# Altium schematic sheet Alaska 1-1.SchDoc
size A0; SheetNumber: 1; SheetTotal: 1
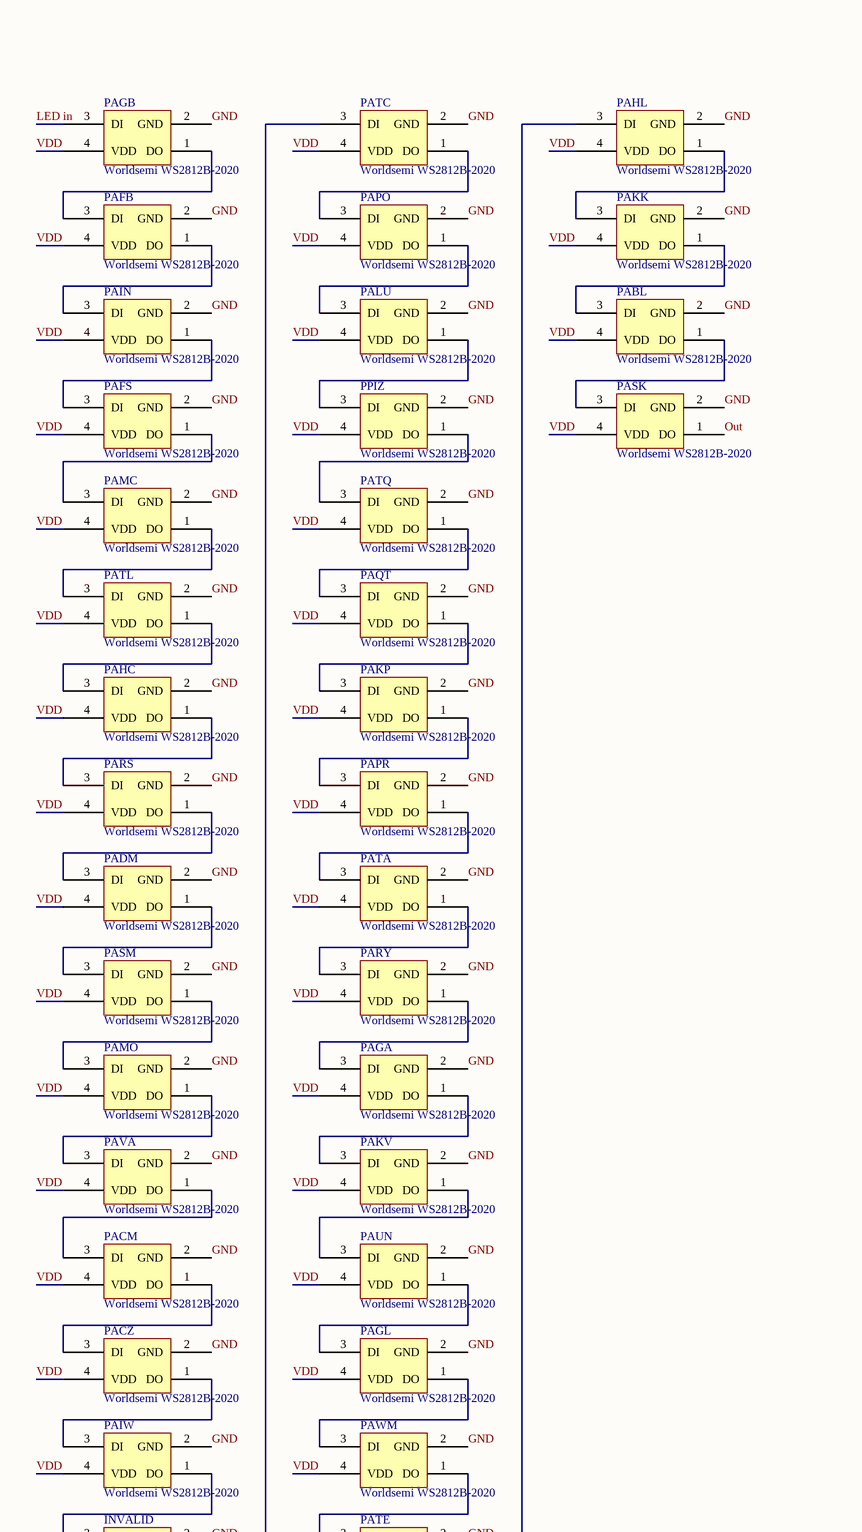
[diagram p0: Alaska 1-1.SchDoc, top left]
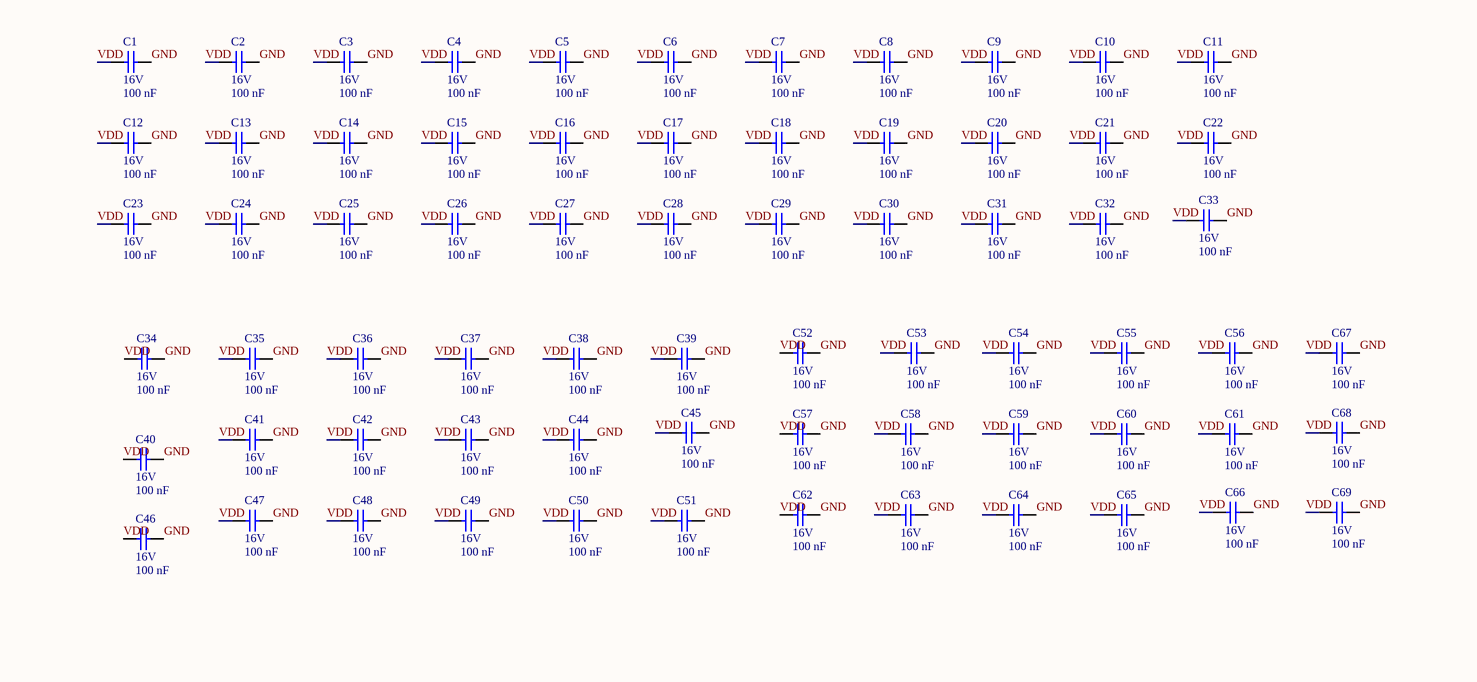
[diagram p1: Alaska 1-1.SchDoc, top middle]
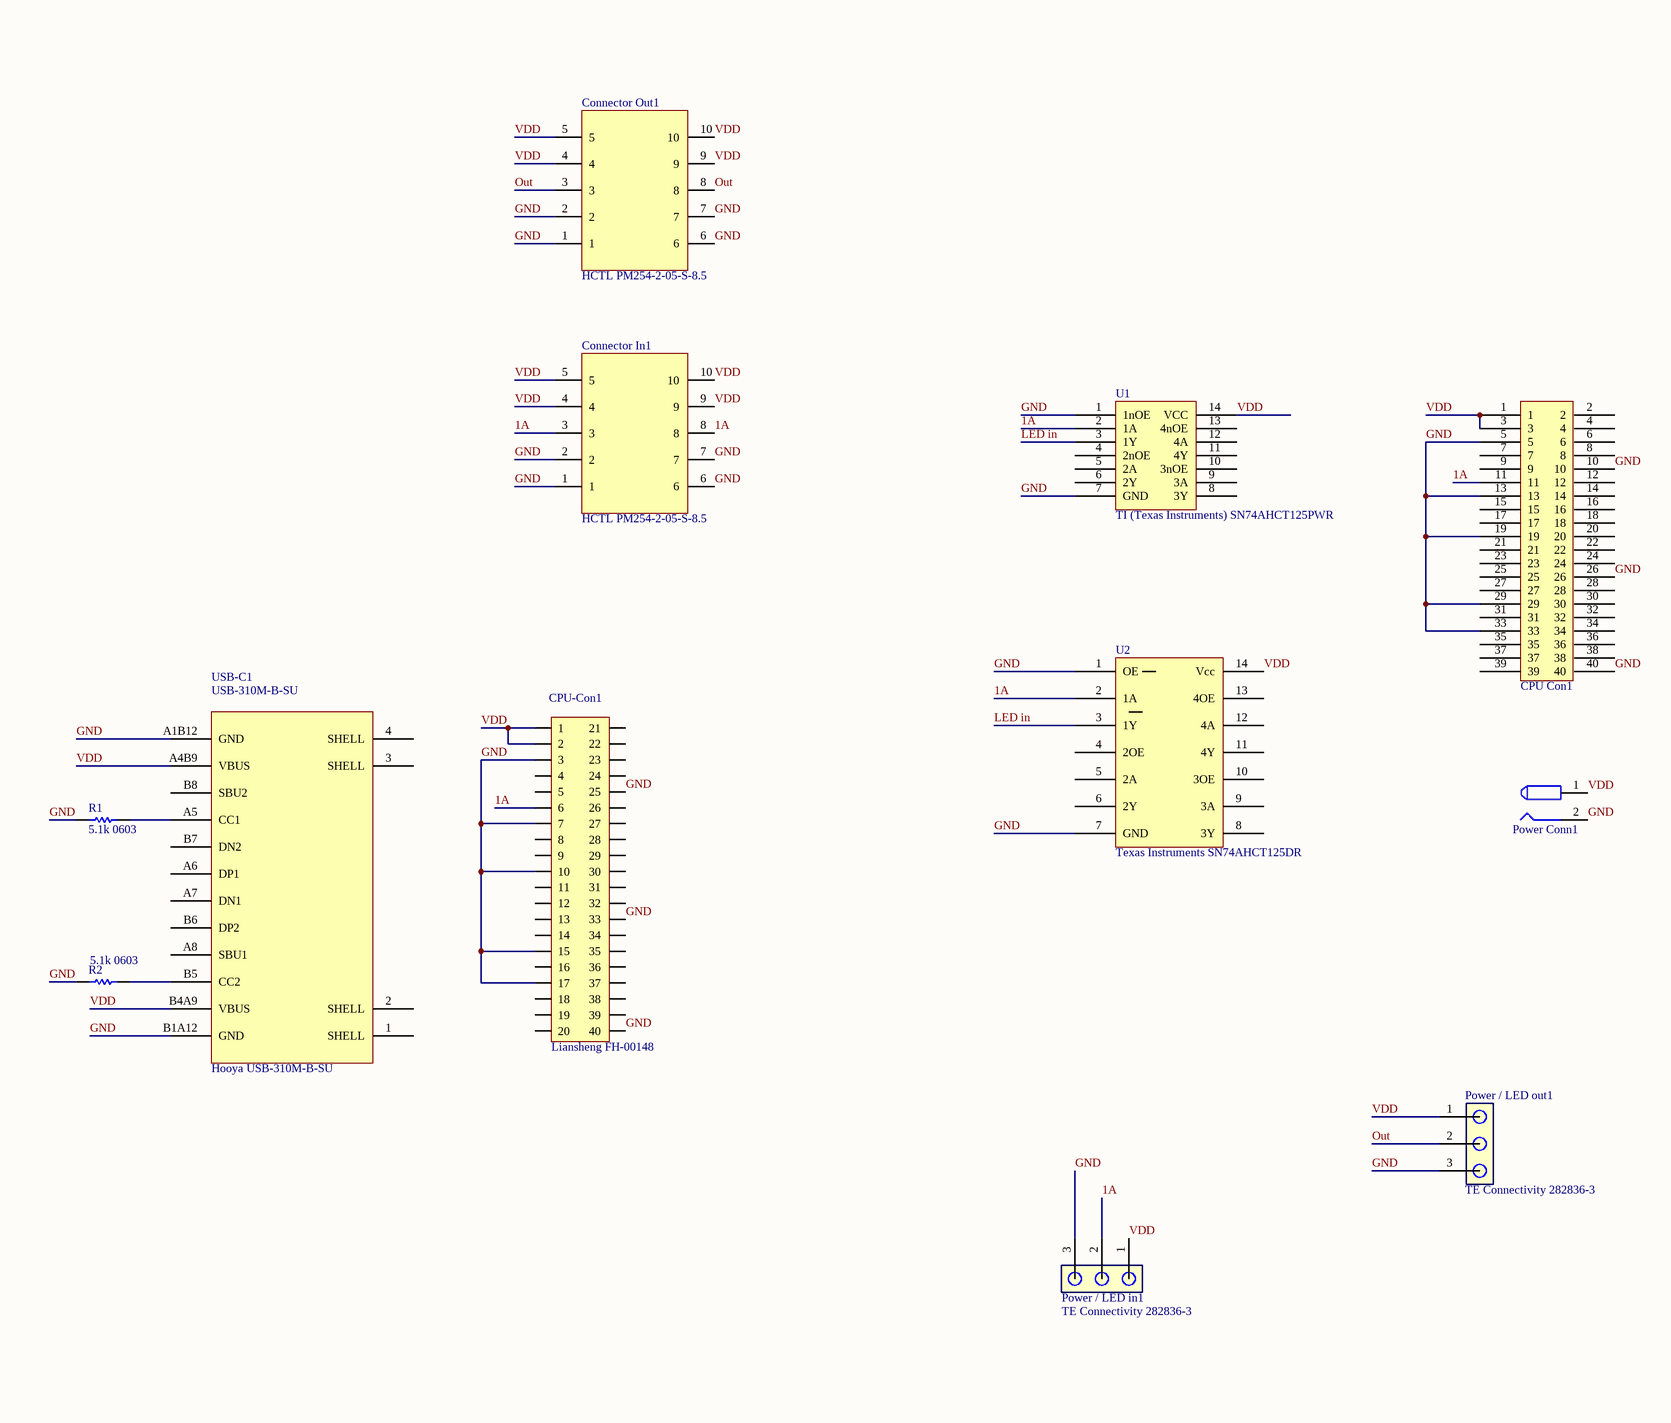
[diagram p2: Alaska 1-1.SchDoc, top right]
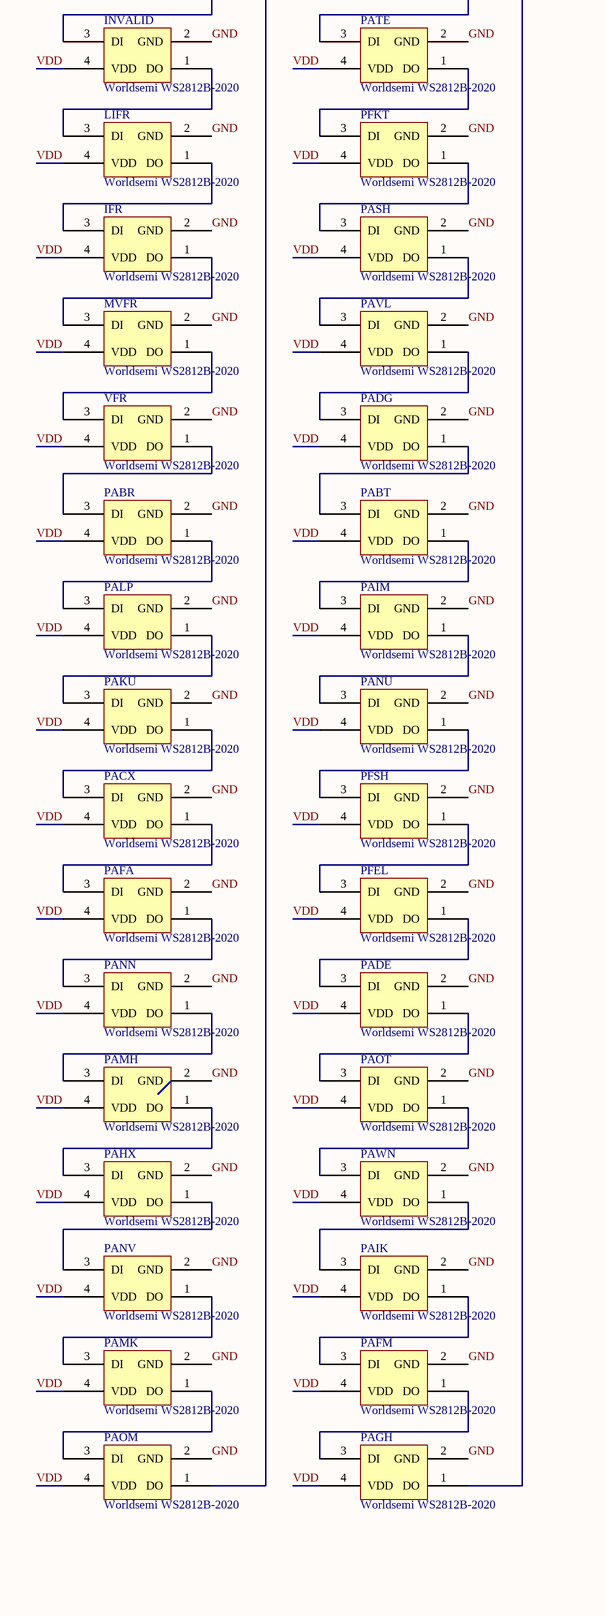
[diagram p3: Alaska 1-1.SchDoc, bottom left]
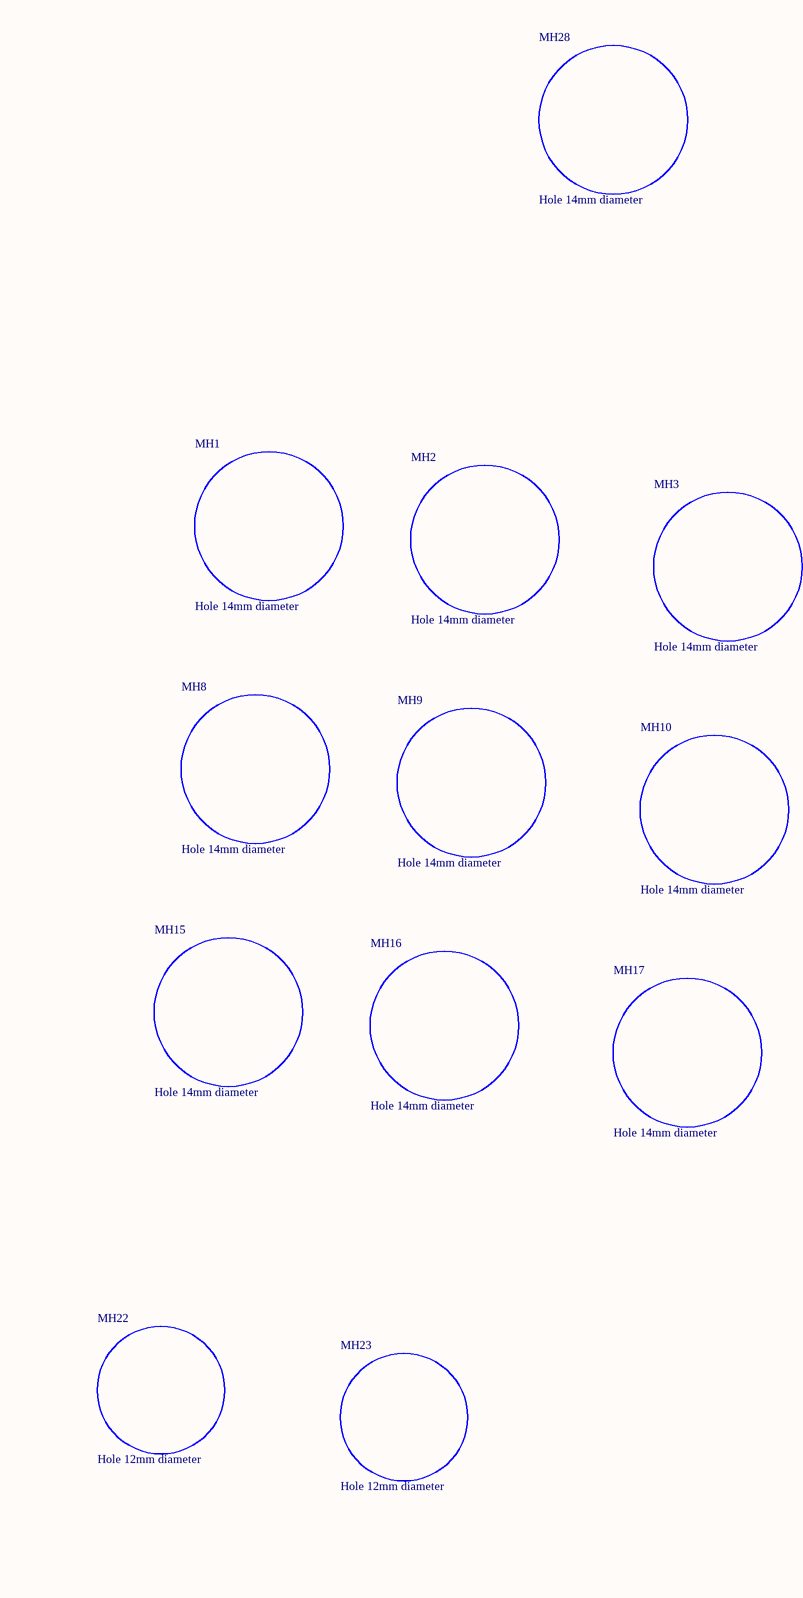
[diagram p4: Alaska 1-1.SchDoc, bottom middle]
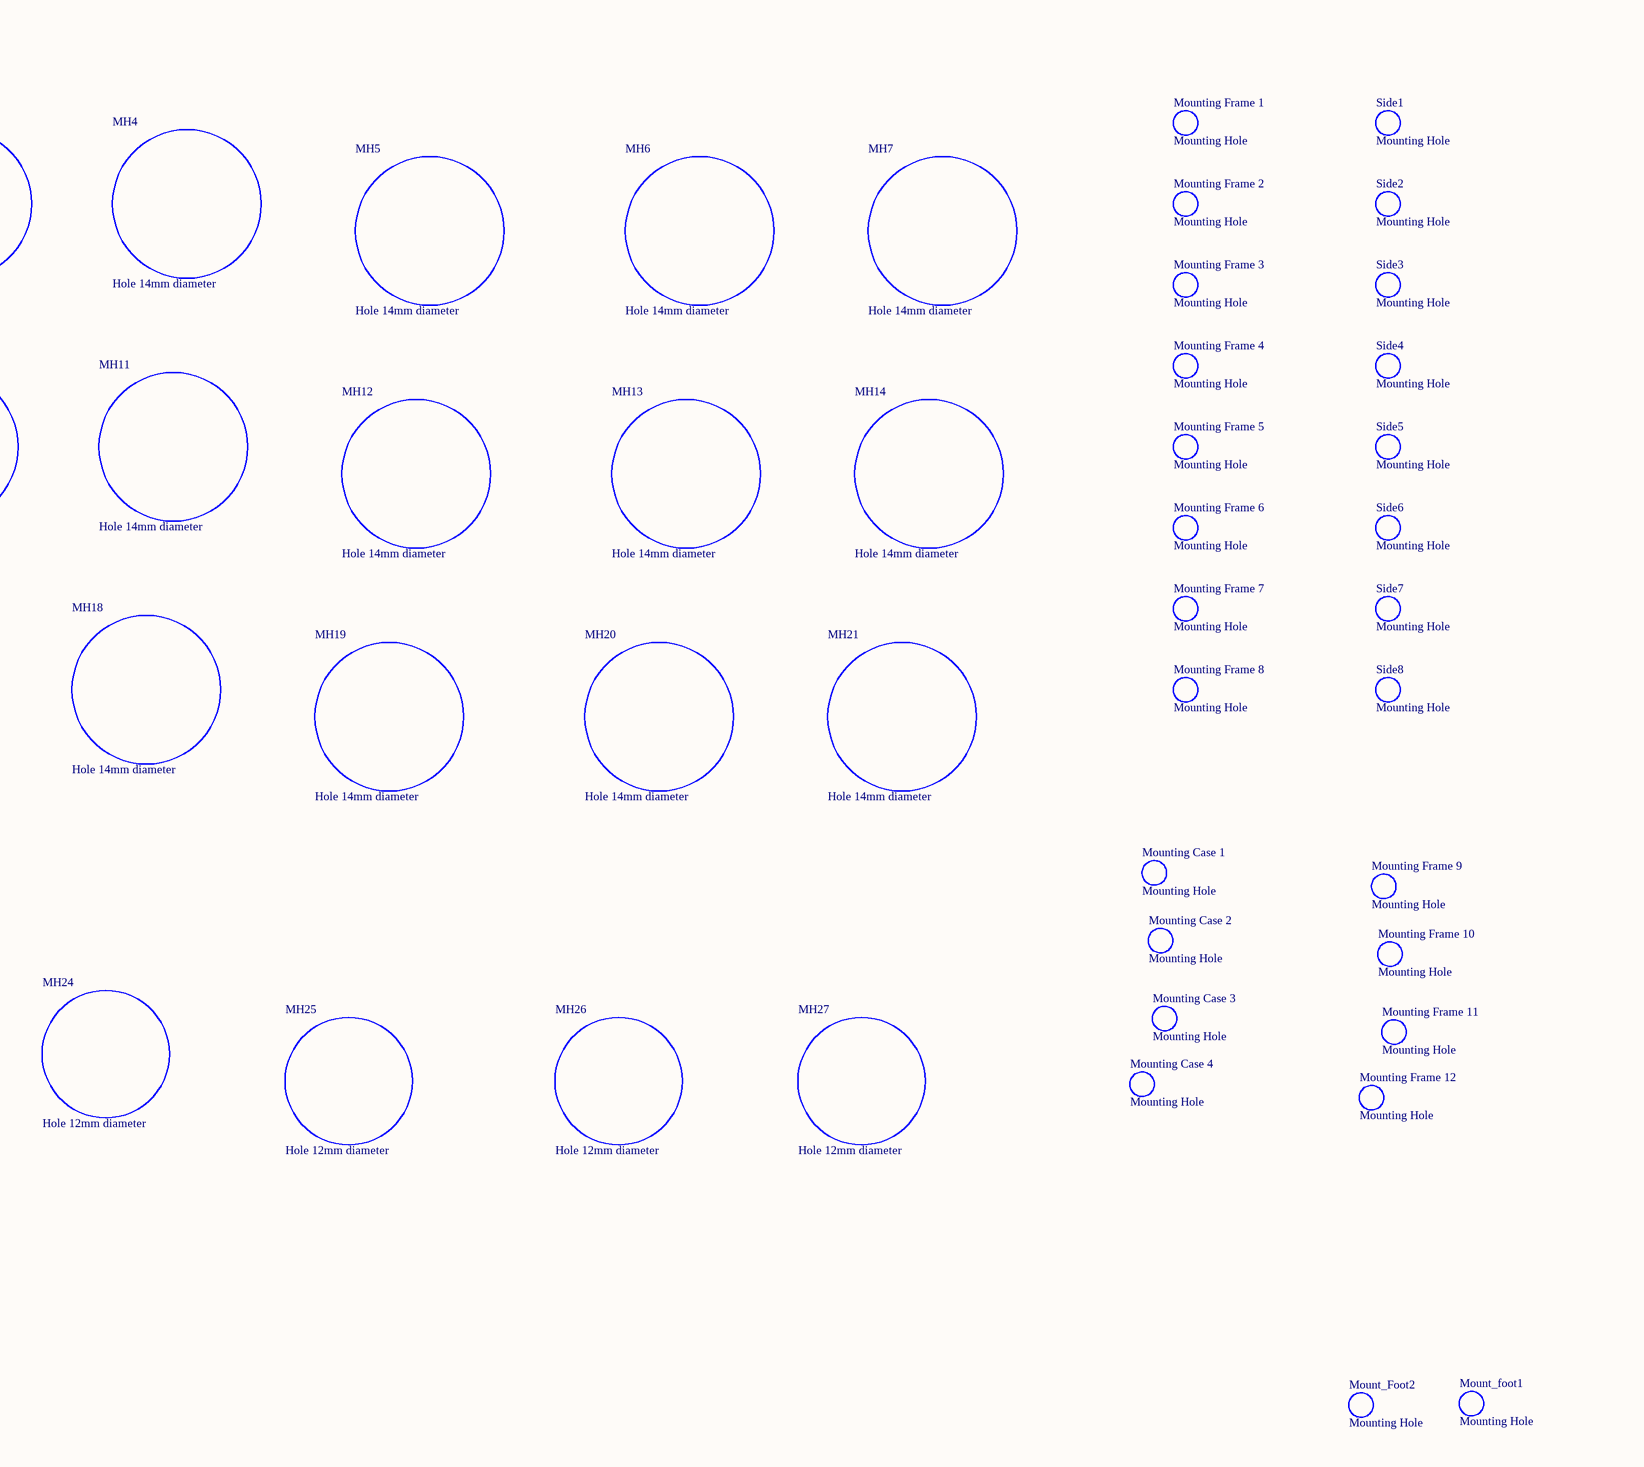
[diagram p5: Alaska 1-1.SchDoc, bottom right]

## Parts
C1  16V  Capacitance: 100 nF  [CAPC1005X56X25NL10T15]
C2  16V  Capacitance: 100 nF  [CAPC1005X56X25NL10T15]
C3  16V  Capacitance: 100 nF  [CAPC1005X56X25NL10T15]
C4  16V  Capacitance: 100 nF  [CAPC1005X56X25NL10T15]
C5  16V  Capacitance: 100 nF  [CAPC1005X56X25NL10T15]
C6  16V  Capacitance: 100 nF  [CAPC1005X56X25NL10T15]
C7  16V  Capacitance: 100 nF  [CAPC1005X56X25NL10T15]
C8  16V  Capacitance: 100 nF  [CAPC1005X56X25NL10T15]
C9  16V  Capacitance: 100 nF  [CAPC1005X56X25NL10T15]
C10  16V  Capacitance: 100 nF  [CAPC1005X56X25NL10T15]
C11  16V  Capacitance: 100 nF  [CAPC1005X56X25NL10T15]
C12  16V  Capacitance: 100 nF  [CAPC1005X56X25NL10T15]
C13  16V  Capacitance: 100 nF  [CAPC1005X56X25NL10T15]
C14  16V  Capacitance: 100 nF  [CAPC1005X56X25NL10T15]
C15  16V  Capacitance: 100 nF  [CAPC1005X56X25NL10T15]
C16  16V  Capacitance: 100 nF  [CAPC1005X56X25NL10T15]
C17  16V  Capacitance: 100 nF  [CAPC1005X56X25NL10T15]
C18  16V  Capacitance: 100 nF  [CAPC1005X56X25NL10T15]
C19  16V  Capacitance: 100 nF  [CAPC1005X56X25NL10T15]
C20  16V  Capacitance: 100 nF  [CAPC1005X56X25NL10T15]
C21  16V  Capacitance: 100 nF  [CAPC1005X56X25NL10T15]
C22  16V  Capacitance: 100 nF  [CAPC1005X56X25NL10T15]
C23  16V  Capacitance: 100 nF  [CAPC1005X56X25NL10T15]
C24  16V  Capacitance: 100 nF  [CAPC1005X56X25NL10T15]
C25  16V  Capacitance: 100 nF  [CAPC1005X56X25NL10T15]
C26  16V  Capacitance: 100 nF  [CAPC1005X56X25NL10T15]
C27  16V  Capacitance: 100 nF  [CAPC1005X56X25NL10T15]
C28  16V  Capacitance: 100 nF  [CAPC1005X56X25NL10T15]
C29  16V  Capacitance: 100 nF  [CAPC1005X56X25NL10T15]
C30  16V  Capacitance: 100 nF  [CAPC1005X56X25NL10T15]
C31  16V  Capacitance: 100 nF  [CAPC1005X56X25NL10T15]
C32  16V  Capacitance: 100 nF  [CAPC1005X56X25NL10T15]
C33  16V  Capacitance: 100 nF  [CAPC1005X56X25NL10T15]
C34  16V  Capacitance: 100 nF  [CAPC1005X56X25NL10T15]
C35  16V  Capacitance: 100 nF  [CAPC1005X56X25NL10T15]
C36  16V  Capacitance: 100 nF  [CAPC1005X56X25NL10T15]
C37  16V  Capacitance: 100 nF  [CAPC1005X56X25NL10T15]
C38  16V  Capacitance: 100 nF  [CAPC1005X56X25NL10T15]
C39  16V  Capacitance: 100 nF  [CAPC1005X56X25NL10T15]
C40  16V  Capacitance: 100 nF  [CAPC1005X56X25NL10T15]
C41  16V  Capacitance: 100 nF  [CAPC1005X56X25NL10T15]
C42  16V  Capacitance: 100 nF  [CAPC1005X56X25NL10T15]
C43  16V  Capacitance: 100 nF  [CAPC1005X56X25NL10T15]
C44  16V  Capacitance: 100 nF  [CAPC1005X56X25NL10T15]
C45  16V  Capacitance: 100 nF  [CAPC1005X56X25NL10T15]
C46  16V  Capacitance: 100 nF  [CAPC1005X56X25NL10T15]
C47  16V  Capacitance: 100 nF  [CAPC1005X56X25NL10T15]
C48  16V  Capacitance: 100 nF  [CAPC1005X56X25NL10T15]
C49  16V  Capacitance: 100 nF  [CAPC1005X56X25NL10T15]
C50  16V  Capacitance: 100 nF  [CAPC1005X56X25NL10T15]
C51  16V  Capacitance: 100 nF  [CAPC1005X56X25NL10T15]
C52  16V  Capacitance: 100 nF  [CAPC1005X56X25NL10T15]
C53  16V  Capacitance: 100 nF  [CAPC1005X56X25NL10T15]
C54  16V  Capacitance: 100 nF  [CAPC1005X56X25NL10T15]
C55  16V  Capacitance: 100 nF  [CAPC1005X56X25NL10T15]
C56  16V  Capacitance: 100 nF  [CAPC1005X56X25NL10T15]
C57  16V  Capacitance: 100 nF  [CAPC1005X56X25NL10T15]
C58  16V  Capacitance: 100 nF  [CAPC1005X56X25NL10T15]
C59  16V  Capacitance: 100 nF  [CAPC1005X56X25NL10T15]
C60  16V  Capacitance: 100 nF  [CAPC1005X56X25NL10T15]
C61  16V  Capacitance: 100 nF  [CAPC1005X56X25NL10T15]
C62  16V  Capacitance: 100 nF  [CAPC1005X56X25NL10T15]
C63  16V  Capacitance: 100 nF  [CAPC1005X56X25NL10T15]
C64  16V  Capacitance: 100 nF  [CAPC1005X56X25NL10T15]
C65  16V  Capacitance: 100 nF  [CAPC1005X56X25NL10T15]
C66  16V  Capacitance: 100 nF  [CAPC1005X56X25NL10T15]
C67  16V  Capacitance: 100 nF  [CAPC1005X56X25NL10T15]
C68  16V  Capacitance: 100 nF  [CAPC1005X56X25NL10T15]
C69  16V  Capacitance: 100 nF  [CAPC1005X56X25NL10T15]
Connector_In1  HCTL PM254-2-05-S-8.5  [PM254-2-05-S-8.5]
Connector_Out1  HCTL PM254-2-05-S-8.5  [PM254-2-05-S-8.5]
CPU-Con1  Liansheng FH-00148  [Liansheng_FH-00148_Footprint_01]
CPU_Con1  40 pin Female connector  [Harwin 40 pin Female]  (value not drawn)
IFR  Worldsemi WS2812B-2020  [PCB-18681qzhn4j348g96a9l-1]
INVALID  Worldsemi WS2812B-2020  [PCB-18681qzhn4j348g96a9l-1]
LIFR  Worldsemi WS2812B-2020  [PCB-18681qzhn4j348g96a9l-1]
MH1  Hole 14mm diameter  [Mounting Hole 14mm]
MH2  Hole 14mm diameter  [Mounting Hole 14mm]
MH3  Hole 14mm diameter  [Mounting Hole 14mm]
MH4  Hole 14mm diameter  [Mounting Hole 14mm]
MH5  Hole 14mm diameter  [Mounting Hole 14mm]
MH6  Hole 14mm diameter  [Mounting Hole 14mm]
MH7  Hole 14mm diameter  [Mounting Hole 14mm]
MH8  Hole 14mm diameter  [Mounting Hole 14mm]
MH9  Hole 14mm diameter  [Mounting Hole 14mm]
MH10  Hole 14mm diameter  [Mounting Hole 14mm]
MH11  Hole 14mm diameter  [Mounting Hole 14mm]
MH12  Hole 14mm diameter  [Mounting Hole 14mm]
MH13  Hole 14mm diameter  [Mounting Hole 14mm]
MH14  Hole 14mm diameter  [Mounting Hole 14mm]
MH15  Hole 14mm diameter  [Mounting Hole 14mm]
MH16  Hole 14mm diameter  [Mounting Hole 14mm]
MH17  Hole 14mm diameter  [Mounting Hole 14mm]
MH18  Hole 14mm diameter  [Mounting Hole 14mm]
MH19  Hole 14mm diameter  [Mounting Hole 14mm]
MH20  Hole 14mm diameter  [Mounting Hole 14mm]
MH21  Hole 14mm diameter  [Mounting Hole 14mm]
MH22  Hole 12mm diameter  [Mounting Hole 12mm]
MH23  Hole 12mm diameter  [Mounting Hole 12mm]
MH24  Hole 12mm diameter  [Mounting Hole 12mm]
MH25  Hole 12mm diameter  [Mounting Hole 12mm]
MH26  Hole 12mm diameter  [Mounting Hole 12mm]
MH27  Hole 12mm diameter  [Mounting Hole 12mm]
MH28  Hole 14mm diameter  [Mounting Hole 14mm]
Mount_foot1  Mounting Hole  [PCB-q0vxx67e01kaxtvhakkm-1]
Mount_Foot2  Mounting Hole  [PCB-q0vxx67e01kaxtvhakkm-1]
Mounting_Case_1  Mounting Hole  [PCB-q0vxx67e01kaxtvhakkm-1]
Mounting_Case_2  Mounting Hole  [PCB-q0vxx67e01kaxtvhakkm-1]
Mounting_Case_3  Mounting Hole  [PCB-q0vxx67e01kaxtvhakkm-1]
Mounting_Case_4  Mounting Hole  [PCB-q0vxx67e01kaxtvhakkm-1]
Mounting_Frame_1  Mounting Hole  [PCB-q0vxx67e01kaxtvhakkm-1]
Mounting_Frame_2  Mounting Hole  [PCB-q0vxx67e01kaxtvhakkm-1]
Mounting_Frame_3  Mounting Hole  [PCB-q0vxx67e01kaxtvhakkm-1]
Mounting_Frame_4  Mounting Hole  [PCB-q0vxx67e01kaxtvhakkm-1]
Mounting_Frame_5  Mounting Hole  [PCB-q0vxx67e01kaxtvhakkm-1]
Mounting_Frame_6  Mounting Hole  [PCB-q0vxx67e01kaxtvhakkm-1]
Mounting_Frame_7  Mounting Hole  [PCB-q0vxx67e01kaxtvhakkm-1]
Mounting_Frame_8  Mounting Hole  [PCB-q0vxx67e01kaxtvhakkm-1]
Mounting_Frame_9  Mounting Hole  [PCB-q0vxx67e01kaxtvhakkm-1]
Mounting_Frame_10  Mounting Hole  [PCB-q0vxx67e01kaxtvhakkm-1]
Mounting_Frame_11  Mounting Hole  [PCB-q0vxx67e01kaxtvhakkm-1]
Mounting_Frame_12  Mounting Hole  [PCB-q0vxx67e01kaxtvhakkm-1]
MVFR  Worldsemi WS2812B-2020  [PCB-18681qzhn4j348g96a9l-1]
PABL  Worldsemi WS2812B-2020  [PCB-18681qzhn4j348g96a9l-1]
PABR  Worldsemi WS2812B-2020  [PCB-18681qzhn4j348g96a9l-1]
PABT  Worldsemi WS2812B-2020  [PCB-18681qzhn4j348g96a9l-1]
PACM  Worldsemi WS2812B-2020  [PCB-18681qzhn4j348g96a9l-1]
PACX  Worldsemi WS2812B-2020  [PCB-18681qzhn4j348g96a9l-1]
PACZ  Worldsemi WS2812B-2020  [PCB-18681qzhn4j348g96a9l-1]
PADE  Worldsemi WS2812B-2020  [PCB-18681qzhn4j348g96a9l-1]
PADG  Worldsemi WS2812B-2020  [PCB-18681qzhn4j348g96a9l-1]
PADM  Worldsemi WS2812B-2020  [PCB-18681qzhn4j348g96a9l-1]
PAFA  Worldsemi WS2812B-2020  [PCB-18681qzhn4j348g96a9l-1]
PAFB  Worldsemi WS2812B-2020  [PCB-18681qzhn4j348g96a9l-1]
PAFM  Worldsemi WS2812B-2020  [PCB-18681qzhn4j348g96a9l-1]
PAFS  Worldsemi WS2812B-2020  [PCB-18681qzhn4j348g96a9l-1]
PAGA  Worldsemi WS2812B-2020  [PCB-18681qzhn4j348g96a9l-1]
PAGB  Worldsemi WS2812B-2020  [PCB-18681qzhn4j348g96a9l-1]
PAGH  Worldsemi WS2812B-2020  [PCB-18681qzhn4j348g96a9l-1]
PAGL  Worldsemi WS2812B-2020  [PCB-18681qzhn4j348g96a9l-1]
PAHC  Worldsemi WS2812B-2020  [PCB-18681qzhn4j348g96a9l-1]
PAHL  Worldsemi WS2812B-2020  [PCB-18681qzhn4j348g96a9l-1]
PAHX  Worldsemi WS2812B-2020  [PCB-18681qzhn4j348g96a9l-1]
PAIK  Worldsemi WS2812B-2020  [PCB-18681qzhn4j348g96a9l-1]
PAIM  Worldsemi WS2812B-2020  [PCB-18681qzhn4j348g96a9l-1]
PAIN  Worldsemi WS2812B-2020  [PCB-18681qzhn4j348g96a9l-1]
PAIW  Worldsemi WS2812B-2020  [PCB-18681qzhn4j348g96a9l-1]
PAKK  Worldsemi WS2812B-2020  [PCB-18681qzhn4j348g96a9l-1]
PAKP  Worldsemi WS2812B-2020  [PCB-18681qzhn4j348g96a9l-1]
PAKU  Worldsemi WS2812B-2020  [PCB-18681qzhn4j348g96a9l-1]
PAKV  Worldsemi WS2812B-2020  [PCB-18681qzhn4j348g96a9l-1]
PALP  Worldsemi WS2812B-2020  [PCB-18681qzhn4j348g96a9l-1]
PALU  Worldsemi WS2812B-2020  [PCB-18681qzhn4j348g96a9l-1]
PAMC  Worldsemi WS2812B-2020  [PCB-18681qzhn4j348g96a9l-1]
PAMH  Worldsemi WS2812B-2020  [PCB-18681qzhn4j348g96a9l-1]
PAMK  Worldsemi WS2812B-2020  [PCB-18681qzhn4j348g96a9l-1]
PAMO  Worldsemi WS2812B-2020  [PCB-18681qzhn4j348g96a9l-1]
PANN  Worldsemi WS2812B-2020  [PCB-18681qzhn4j348g96a9l-1]
PANU  Worldsemi WS2812B-2020  [PCB-18681qzhn4j348g96a9l-1]
PANV  Worldsemi WS2812B-2020  [PCB-18681qzhn4j348g96a9l-1]
PAOM  Worldsemi WS2812B-2020  [PCB-18681qzhn4j348g96a9l-1]
PAOT  Worldsemi WS2812B-2020  [PCB-18681qzhn4j348g96a9l-1]
PAPO  Worldsemi WS2812B-2020  [PCB-18681qzhn4j348g96a9l-1]
PAPR  Worldsemi WS2812B-2020  [PCB-18681qzhn4j348g96a9l-1]
PAQT  Worldsemi WS2812B-2020  [PCB-18681qzhn4j348g96a9l-1]
PARS  Worldsemi WS2812B-2020  [PCB-18681qzhn4j348g96a9l-1]
PARY  Worldsemi WS2812B-2020  [PCB-18681qzhn4j348g96a9l-1]
PASH  Worldsemi WS2812B-2020  [PCB-18681qzhn4j348g96a9l-1]
PASK  Worldsemi WS2812B-2020  [PCB-18681qzhn4j348g96a9l-1]
PASM  Worldsemi WS2812B-2020  [PCB-18681qzhn4j348g96a9l-1]
PATA  Worldsemi WS2812B-2020  [PCB-18681qzhn4j348g96a9l-1]
PATC  Worldsemi WS2812B-2020  [PCB-18681qzhn4j348g96a9l-1]
PATE  Worldsemi WS2812B-2020  [PCB-18681qzhn4j348g96a9l-1]
PATL  Worldsemi WS2812B-2020  [PCB-18681qzhn4j348g96a9l-1]
PATQ  Worldsemi WS2812B-2020  [PCB-18681qzhn4j348g96a9l-1]
PAUN  Worldsemi WS2812B-2020  [PCB-18681qzhn4j348g96a9l-1]
PAVA  Worldsemi WS2812B-2020  [PCB-18681qzhn4j348g96a9l-1]
PAVL  Worldsemi WS2812B-2020  [PCB-18681qzhn4j348g96a9l-1]
PAWM  Worldsemi WS2812B-2020  [PCB-18681qzhn4j348g96a9l-1]
PAWN  Worldsemi WS2812B-2020  [PCB-18681qzhn4j348g96a9l-1]
PFEL  Worldsemi WS2812B-2020  [PCB-18681qzhn4j348g96a9l-1]
PFKT  Worldsemi WS2812B-2020  [PCB-18681qzhn4j348g96a9l-1]
PFSH  Worldsemi WS2812B-2020  [PCB-18681qzhn4j348g96a9l-1]
Power_/_LED_in1  TE Connectivity 282836-3  [282836-3]
Power_/_LED_out1  TE Connectivity 282836-3  [282836-3]
Power_Conn1  CMP-330397-12  [PCB-h5dulpljww4oyv25n50t-1]  (value not drawn)
PPIZ  Worldsemi WS2812B-2020  [PCB-18681qzhn4j348g96a9l-1]
R1  5.1k 0603  [CAPC1608X90X35NL15T15]
R2  5.1k 0603  [CAPC1608X90X35NL15T15]
Side1  Mounting Hole  [PCB-q0vxx67e01kaxtvhakkm-1]
Side2  Mounting Hole  [PCB-q0vxx67e01kaxtvhakkm-1]
Side3  Mounting Hole  [PCB-q0vxx67e01kaxtvhakkm-1]
Side4  Mounting Hole  [PCB-q0vxx67e01kaxtvhakkm-1]
Side5  Mounting Hole  [PCB-q0vxx67e01kaxtvhakkm-1]
Side6  Mounting Hole  [PCB-q0vxx67e01kaxtvhakkm-1]
Side7  Mounting Hole  [PCB-q0vxx67e01kaxtvhakkm-1]
Side8  Mounting Hole  [PCB-q0vxx67e01kaxtvhakkm-1]
U1  TI (Texas Instruments) SN74AHCT125PWR  [PCB-19361381-1]
U2  Texas Instruments SN74AHCT125DR  [PCB-4n9l8bvb0hxmq9svv09s-1]
USB-C1  Hooya USB-310M-B-SU  [Hooya USB-310M-B-SU-Footprint-1]
VFR  Worldsemi WS2812B-2020  [PCB-18681qzhn4j348g96a9l-1]

## Nets
1A: Connector_In1.3 Connector_In1.8 CPU-Con1.6 CPU_Con1.11 Power_/_LED_in1.2 U1.2(1A) U2.2(1A)
GND: C1.2 C2.2 C3.2 C4.2 C5.2 C6.2 C7.2 C8.2 C9.2 C10.2 C11.2 C12.2 C13.2 C14.2 C15.2 C16.2 C17.2 C18.2 C19.2 C20.2 C21.2 C22.2 C23.2 C24.2 C25.2 C26.2 C27.2 C28.2 C29.2 C30.2 C31.2 C32.2 C33.2 C34.2 C35.2 C36.2 C37.2 C38.2 C39.2 C40.2 C41.2 C42.2 C43.2 C44.2 C45.2 C46.2 C47.2 C48.2 C49.2 C50.2 C51.2 C52.2 C53.2 C54.2 C55.2 C56.2 C57.2 C58.2 C59.2 C60.2 C61.2 C62.2 C63.2 C64.2 C65.2 C66.2 C67.2 C68.2 C69.2 Connector_In1.1 Connector_In1.2 Connector_In1.6 Connector_In1.7 Connector_Out1.1 Connector_Out1.2 Connector_Out1.6 Connector_Out1.7 CPU-Con1.3 CPU-Con1.7 CPU-Con1.10 CPU-Con1.15 CPU-Con1.17 CPU-Con1.25 CPU-Con1.33 CPU-Con1.40 CPU_Con1.5 CPU_Con1.10 CPU_Con1.13 CPU_Con1.19 CPU_Con1.26 CPU_Con1.29 CPU_Con1.33 CPU_Con1.40 IFR.2(GND) INVALID.2(GND) LIFR.2(GND) MVFR.2(GND) PABL.2(GND) PABR.2(GND) PABT.2(GND) PACM.2(GND) PACX.2(GND) PACZ.2(GND) PADE.2(GND) PADG.2(GND) PADM.2(GND) PAFA.2(GND) PAFB.2(GND) PAFM.2(GND) PAFS.2(GND) PAGA.2(GND) PAGB.2(GND) PAGH.2(GND) PAGL.2(GND) PAHC.2(GND) PAHL.2(GND) PAHX.2(GND) PAIK.2(GND) PAIM.2(GND) PAIN.2(GND) PAIW.2(GND) PAKK.2(GND) PAKP.2(GND) PAKU.2(GND) PAKV.2(GND) PALP.2(GND) PALU.2(GND) PAMC.2(GND) PAMH.2(GND) PAMK.2(GND) PAMO.2(GND) PANN.2(GND) PANU.2(GND) PANV.2(GND) PAOM.2(GND) PAOT.2(GND) PAPO.2(GND) PAPR.2(GND) PAQT.2(GND) PARS.2(GND) PARY.2(GND) PASH.2(GND) PASK.2(GND) PASM.2(GND) PATA.2(GND) PATC.2(GND) PATE.2(GND) PATL.2(GND) PATQ.2(GND) PAUN.2(GND) PAVA.2(GND) PAVL.2(GND) PAWM.2(GND) PAWN.2(GND) PFEL.2(GND) PFKT.2(GND) PFSH.2(GND) Power_/_LED_in1.3 Power_/_LED_out1.3 Power_Conn1.2(NEG) PPIZ.2(GND) R1.1 R2.1 U1.1(1nOE) U1.7(GND) U2.1(OE) U2.7(GND) USB-C1.A1B12(GND) USB-C1.B1A12(GND) VFR.2(GND)
LED in: PAGB.3(DI) U1.3(1Y) U2.3(1Y)
Out: Connector_Out1.3 Connector_Out1.8 PASK.1(DO) Power_/_LED_out1.2
VDD: C1.1 C2.1 C3.1 C4.1 C5.1 C6.1 C7.1 C8.1 C9.1 C10.1 C11.1 C12.1 C13.1 C14.1 C15.1 C16.1 C17.1 C18.1 C19.1 C20.1 C21.1 C22.1 C23.1 C24.1 C25.1 C26.1 C27.1 C28.1 C29.1 C30.1 C31.1 C32.1 C33.1 C34.1 C35.1 C36.1 C37.1 C38.1 C39.1 C40.1 C41.1 C42.1 C43.1 C44.1 C45.1 C46.1 C47.1 C48.1 C49.1 C50.1 C51.1 C52.1 C53.1 C54.1 C55.1 C56.1 C57.1 C58.1 C59.1 C60.1 C61.1 C62.1 C63.1 C64.1 C65.1 C66.1 C67.1 C68.1 C69.1 Connector_In1.4 Connector_In1.5 Connector_In1.9 Connector_In1.10 Connector_Out1.4 Connector_Out1.5 Connector_Out1.9 Connector_Out1.10 CPU-Con1.1 CPU-Con1.2 CPU_Con1.1 CPU_Con1.3 IFR.4(VDD) INVALID.4(VDD) LIFR.4(VDD) MVFR.4(VDD) PABL.4(VDD) PABR.4(VDD) PABT.4(VDD) PACM.4(VDD) PACX.4(VDD) PACZ.4(VDD) PADE.4(VDD) PADG.4(VDD) PADM.4(VDD) PAFA.4(VDD) PAFB.4(VDD) PAFM.4(VDD) PAFS.4(VDD) PAGA.4(VDD) PAGB.4(VDD) PAGH.4(VDD) PAGL.4(VDD) PAHC.4(VDD) PAHL.4(VDD) PAHX.4(VDD) PAIK.4(VDD) PAIM.4(VDD) PAIN.4(VDD) PAIW.4(VDD) PAKK.4(VDD) PAKP.4(VDD) PAKU.4(VDD) PAKV.4(VDD) PALP.4(VDD) PALU.4(VDD) PAMC.4(VDD) PAMH.4(VDD) PAMK.4(VDD) PAMO.4(VDD) PANN.4(VDD) PANU.4(VDD) PANV.4(VDD) PAOM.4(VDD) PAOT.4(VDD) PAPO.4(VDD) PAPR.4(VDD) PAQT.4(VDD) PARS.4(VDD) PARY.4(VDD) PASH.4(VDD) PASK.4(VDD) PASM.4(VDD) PATA.4(VDD) PATC.4(VDD) PATE.4(VDD) PATL.4(VDD) PATQ.4(VDD) PAUN.4(VDD) PAVA.4(VDD) PAVL.4(VDD) PAWM.4(VDD) PAWN.4(VDD) PFEL.4(VDD) PFKT.4(VDD) PFSH.4(VDD) Power_/_LED_in1.1 Power_/_LED_out1.1 Power_Conn1.1(POS) PPIZ.4(VDD) U1.14(VCC) U2.14(Vcc) USB-C1.A4B9(VBUS) USB-C1.B4A9(VBUS) VFR.4(VDD)
NetIFR_1: IFR.1(DO) MVFR.3(DI)
NetIFR_3: IFR.3(DI) LIFR.1(DO)
NetINVALID_1: INVALID.1(DO) LIFR.3(DI)
NetINVALID_3: INVALID.3(DI) PAIW.1(DO)
NetMVFR_1: MVFR.1(DO) VFR.3(DI)
NetPABL_1: PABL.1(DO) PASK.3(DI)
NetPABL_3: PABL.3(DI) PAKK.1(DO)
NetPABR_1: PABR.1(DO) PALP.3(DI)
NetPABR_3: PABR.3(DI) VFR.1(DO)
NetPABT_1: PABT.1(DO) PAIM.3(DI)
NetPABT_3: PABT.3(DI) PADG.1(DO)
NetPACM_1: PACM.1(DO) PACZ.3(DI)
NetPACM_3: PACM.3(DI) PAVA.1(DO)
NetPACX_1: PACX.1(DO) PAFA.3(DI)
NetPACX_3: PACX.3(DI) PAKU.1(DO)
NetPACZ_1: PACZ.1(DO) PAIW.3(DI)
NetPADE_1: PADE.1(DO) PAOT.3(DI)
NetPADE_3: PADE.3(DI) PFEL.1(DO)
NetPADG_3: PADG.3(DI) PAVL.1(DO)
NetPADM_1: PADM.1(DO) PASM.3(DI)
NetPADM_3: PADM.3(DI) PARS.1(DO)
NetPAFA_1: PAFA.1(DO) PANN.3(DI)
NetPAFB_1: PAFB.1(DO) PAIN.3(DI)
NetPAFB_3: PAFB.3(DI) PAGB.1(DO)
NetPAFM_1: PAFM.1(DO) PAGH.3(DI)
NetPAFM_3: PAFM.3(DI) PAIK.1(DO)
NetPAFS_1: PAFS.1(DO) PAMC.3(DI)
NetPAFS_3: PAFS.3(DI) PAIN.1(DO)
NetPAGA_1: PAGA.1(DO) PAKV.3(DI)
NetPAGA_3: PAGA.3(DI) PARY.1(DO)
NetPAGH_1: PAGH.1(DO) PAHL.3(DI)
NetPAGL_1: PAGL.1(DO) PAWM.3(DI)
NetPAGL_3: PAGL.3(DI) PAUN.1(DO)
NetPAHC_1: PAHC.1(DO) PARS.3(DI)
NetPAHC_3: PAHC.3(DI) PATL.1(DO)
NetPAHL_1: PAHL.1(DO) PAKK.3(DI)
NetPAHX_1: PAHX.1(DO) PANV.3(DI)
NetPAHX_3: PAHX.3(DI) PAMH.1(DO)
NetPAIK_3: PAIK.3(DI) PAWN.1(DO)
NetPAIM_1: PAIM.1(DO) PANU.3(DI)
NetPAKP_1: PAKP.1(DO) PAPR.3(DI)
NetPAKP_3: PAKP.3(DI) PAQT.1(DO)
NetPAKU_3: PAKU.3(DI) PALP.1(DO)
NetPAKV_1: PAKV.1(DO) PAUN.3(DI)
NetPALU_1: PALU.1(DO) PPIZ.3(DI)
NetPALU_3: PALU.3(DI) PAPO.1(DO)
NetPAMC_1: PAMC.1(DO) PATL.3(DI)
NetPAMH_3: PAMH.3(DI) PANN.1(DO)
NetPAMK_1: PAMK.1(DO) PAOM.3(DI)
NetPAMK_3: PAMK.3(DI) PANV.1(DO)
NetPAMO_1: PAMO.1(DO) PAVA.3(DI)
NetPAMO_3: PAMO.3(DI) PASM.1(DO)
NetPANU_1: PANU.1(DO) PFSH.3(DI)
NetPAOM_1: PAOM.1(DO) PATC.3(DI)
NetPAOT_1: PAOT.1(DO) PAWN.3(DI)
NetPAPO_3: PAPO.3(DI) PATC.1(DO)
NetPAPR_1: PAPR.1(DO) PATA.3(DI)
NetPAQT_3: PAQT.3(DI) PATQ.1(DO)
NetPARY_3: PARY.3(DI) PATA.1(DO)
NetPASH_1: PASH.1(DO) PAVL.3(DI)
NetPASH_3: PASH.3(DI) PFKT.1(DO)
NetPATE_1: PATE.1(DO) PFKT.3(DI)
NetPATE_3: PATE.3(DI) PAWM.1(DO)
NetPATQ_3: PATQ.3(DI) PPIZ.1(DO)
NetPFEL_3: PFEL.3(DI) PFSH.1(DO)
NetR1_2: R1.2 USB-C1.A5(CC1)
NetR2_2: R2.2 USB-C1.B5(CC2)

Not connected (* = marked no-connect by the designer): CPU-Con1 4 5 8 9 11 12 13 14 16 18 19 20 21 22 23 24 26 27 28 29 30 31 32 34 35 36 37 38 39; CPU_Con1 2 4 6 7 8 9 12 14 15 16 17 18 20 21 22 23 24 25 27 28 30 31 32 34 35 36 37 38 39; U1 4(2nOE) 5(2A) 6(2Y) 8(3Y) 9(3A) 10(3nOE) 11(4Y) 12(4A) 13(4nOE); U2 4(2OE) 5(2A) 6(2Y) 8(3Y) 9(3A) 10(3OE) 11(4Y) 12(4A) 13(4OE); USB-C1 1(SHELL) 2(SHELL) 3(SHELL) 4(SHELL) A6(DP1) A7(DN1) A8(SBU1) B6(DP2) B7(DN2) B8(SBU2)

## Library data of the parts
C1-C69 = CMP-bf2276a55d9a60e5-20: Generic CAP 0402, =Capacitance+','+Tolerance+','+Voltage+','+Dielectric+','+Case; Manufacturer Part Number: TBD; Lead-Free Status: Lead Free; Voltage: 25V; Dielectric: CGO; Tolerance: ±10%; Octopart URL: TBD; Case: 0402; OctopartID: 0755ced2c795d892; RoHS: Compliant; Mounting Style: Surface Mount; Footprint: PCB-0002-00476-3
Connector_In1 Connector_Out1 = PM254-2-05-S-8.5: 2.54mm 2.54mm 260℃@5S 3A -40℃~+105℃ Copper Alloy 10P Brick nogging 2x5P Top 8.5mm Square Hole SMD,P=2.54mm Female Headers ROHS; ComponentLink1Description: New link; ComponentLink1URL: https://www.lcsc.com/product-detail/Female-Headers_HCTL-PM254-2-05-S-8-5_C3975150.html
CPU-Con1 = CMP-xf5hfsu41fuj64nwsg7i-2: 2.54mm 2.54mm 3A Gold Brass -40℃~+105℃ 260℃@10S Brick nogging 2x20P 7.1mm Top 40 Square Holes SMD,P=2.54mm Female Headers ROHS; ComponentLink1Description: Website; ComponentLink1URL: https://www.lcsc.com/product-detail/Female-Headers_Liansheng-FH-00148_C2685092.html; CustomComponentID: xf5hfsu41fuj64nwsg7i
CPU_Con1 = CMP-2482621-16: 2.54mm (0.1") Pitch DIL Vertical PC Tail Socket Assembly, tin, 20+20 contacts
IFR INVALID LIFR MVFR PABL PABR PABT PACM PACX PACZ PADE PADG PADM PAFA PAFB PAFM PAFS PAGA PAGB PAGH PAGL PAHC PAHL PAHX PAIK PAIM PAIN PAIW PAKK PAKP PAKU PAKV PALP PALU PAMC PAMH PAMK PAMO PANN PANU PANV PAOM PAOT PAPO PAPR PAQT PARS PARY PASH PASK PASM PATA PATC PATE PATL PATQ PAUN PAVA PAVL PAWM PAWN PFEL PFKT PFSH PPIZ VFR = CMP-30b1feb25fa9ef76-6: Manufacturer Part Number: WS2812B-2020; Octopart URL: https://octopart.com/ws2812b-2020-worldsemi-118049406; OctopartID: 30b1feb25fa9ef76
MH1-MH21 MH28 = Mounting Hole 14mm: Hole for mounting
MH22-MH27 = Mounting Hole 12mm: Hole for mounting
Mount_foot1 Mount_Foot2 Mounting_Case_1-Mounting_Case_4 Mounting_Frame_1-Mounting_Frame_12 Side1-Side8 = CMP-q3gk3wg8yin1w7wp8pag-1: Mounting Hole 3.5mm; CustomComponentID: q3gk3wg8yin1w7wp8pag
Power_/_LED_in1 Power_/_LED_out1 = CMP-d7c21c93a45c0805-15: Conn; Term Blk; Wire Receptacle; 3; 5 mm; 30-16 AWG; Green; 13.5 A; 300 V; Number of Contacts: 3; Lead-Free Status: Lead Free; Pin Pitch: 5.00 mm; Wire Gauge: 15.0 AWG; Voltage Rating (AC): 250 V; Current Rating: 13.5 A; ELV Compliant: Compliant; Octopart URL: http://octopart.com/282836-3-te+connectivity-39540472; Manufacturer Part Number: 282836-3; Housing Material: Nylon 6/6; Housing Color: Green; RoHS: Compliant; Orientation: Right Angle; Mounting Style: PCB; Number of Positions: 3; Insulation Material: Nylon; Flammability Rating: UL 94 V-0; OctopartID: d7c21c93a45c0805; Lifecycle Status: Active; REACH SVHC Compliance: No SVHC; Color: Green; Contact Plating: Tin; Contact Material: Brass
Power_Conn1 = CMP-330397-12: CUI PJ-037A; Shielding: No
R1 R2 = CMP-3656428-4: Res Thick Film 0603 5.1K Ohm 1% 1/10W ±100ppm/°C Molded SMD SMD Punched Carrier T/R; Manufacturer Part Number: ERJ-3EKF5101V; Voltage Rating (DC): 75.0 V; Power Rating: 100 mW; Lead-Free Status: Lead Free; Resistance: 5.1 kΩ; REACH SVHC Compliance: No SVHC; Lifecycle Status: Not Listed by Manufacturer; Packaging: Cut Tape (CT); Mounting Style: Surface Mount; RoHS: Compliant; OctopartID: 45aa8fedcba59a6d; Case/Package: 0603; Octopart URL: http://octopart.com/erj-3ekf5101v-panasonic-55421801; Resistance Tolerance: ±1%
U1 = CMP-13613041-2: IC BUS BUFFER TRI-ST QD 14TSSOP; Lead-Free Status: Lead Free; Number of Bits: 4; Output Current Drive: -0.001 A; Propagation Delay Max (tpd): 8.5e-09 s; Voltage Nodes: 5.0 V; Case/Package: TSSOP; Lifecycle Status: Active; Mounting Style: Surface Mount; Number of Circuits: 4; Number of Outputs: 4; Number of Pins: 14; Octopart Url: https://octopart.com/sn74ahct125pwr-texas+instruments-46548606; OctopartID: 822b49e7e1335dec; Packaging: Cut Tape (CT); REACH SVHC Compliance: No SVHC; RoHS: Compliant; Manufacturer Part Number: SN74AHCT125PWR
U2 = CMP-35ebfce60942ea2c-2: Buffer/Line Driver 4-CH Non-Inverting 3-ST CMOS 14-Pin SOIC T/R; Number of Outputs: 4; Voltage Nodes: 5.00 V; Propagation Delay Max (tpd): 8.50 ns; Quiescent Current: 2.00 µA (max); Supply Voltage (DC): 4.50 V to 5.50 V; Output Current Drive: -1.00 mA; Lead-Free Status: Lead Free; Packaging: Tape & Reel (TR); Lifecycle Status: Active; Operating Temperature: -40.0 °C (min); Manufacturer Part Number: SN74AHCT125DR; Case/Package: SOIC-14_3.9x8.7x1.27P; Mounting Style: Surface Mount; OctopartID: 35ebfce60942ea2c; Octopart URL: https://octopart.com/sn74ahct125dr-texas+instruments-465359; RoHS: Compliant; Number of Pins: 14; REACH SVHC Compliance: No SVHC; Number of Circuits: 4; Number of Bits: 4
USB-C1 = CMP-967358be92de49b4-1: 3A 1 Surface Mount 16 Female Type-C SMD USB Connector ROHS; Manufacturer Part Number: USB-310M-B-SU; OctopartID: 967358be92de49b4; Octopart Url: https://octopart.com/usb-310m-b-su-hooya-130490827